# Altium schematic sheet USB Host.SchDoc
size A4
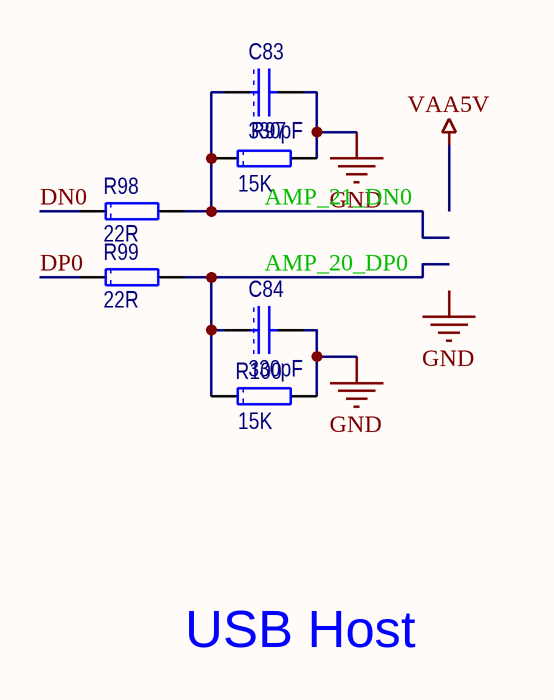
[diagram p0: USB Host.SchDoc]

## Parts
C83  330pF  [1608[0603]]
C84  330pF  [1608[0603]]
R97  15K  [1608[0603]R]
R98  22R  [1608[0603]R]
R99  22R  [1608[0603]R]
R100  15K  [1608[0603]R]

## Nets
GND: C83.2 C84.2 R97.2 R100.2
AMP_20_DP0: C84.1 R99.2 R100.1
AMP_21_DN0: C83.1 R97.1 R98.2
DN0: R98.1
DP0: R99.1

## Notes on the sheet
- USB Host
- Labels drawn without touching a wire or pin: GND

## Library data of the parts
C83 C84 = CAP: Capacitor; Manufacturer: TDK; Type: 无铅电容; Model: C0603X7R1H331K; Value: 330pF
R97 R100 = RES: Manufacturer: vishay; Model: RT0603DRD7D15KL; Value: 15K; Type: 无铅电阻
R98 R99 = RES: Manufacturer: vishay; Model: CRCW060322R0KKEDTR; Value: 22R; Type: 无铅电阻